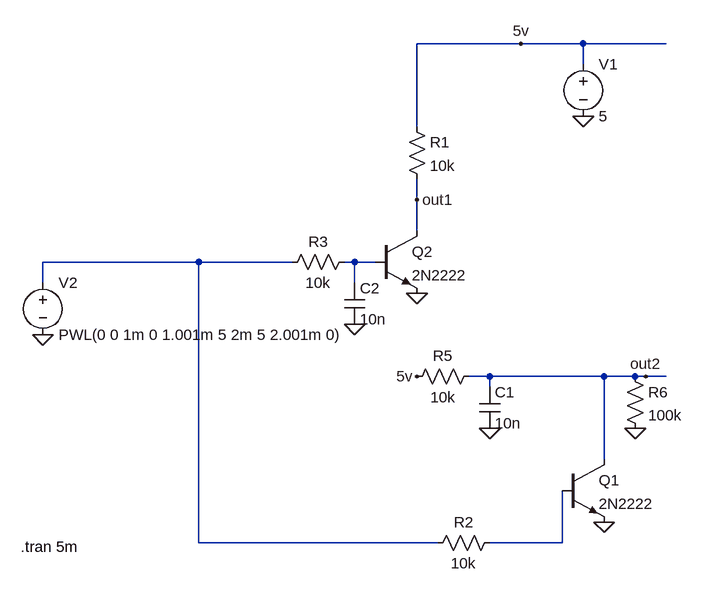
[diagram p0: schematic Draft7.asc]
Draft7.asc, the LTspice schematic file:
Version 4
SHEET 1 880 680
WIRE 144 -320 -16 -320
WIRE 240 -320 144 -320
WIRE 368 -320 240 -320
WIRE 240 -288 240 -320
WIRE -16 -192 -16 -320
WIRE -16 -80 -16 -112
WIRE -16 -32 -16 -80
WIRE -352 16 -592 16
WIRE -208 16 -352 16
WIRE -112 16 -128 16
WIRE -80 16 -112 16
WIRE -592 48 -592 16
WIRE -112 48 -112 16
WIRE 96 192 64 192
WIRE 272 192 96 192
WIRE 320 192 272 192
WIRE 336 192 320 192
WIRE 368 192 336 192
WIRE 96 208 96 192
WIRE 272 320 272 192
WIRE -352 448 -352 16
WIRE 16 448 -352 448
WIRE 208 448 208 368
WIRE 208 448 96 448
FLAG 240 -208 0
FLAG -16 64 0
FLAG 320 272 0
FLAG 144 -320 5v
FLAG -16 192 5v
FLAG -592 128 0
FLAG 96 272 0
FLAG -16 -80 out1
FLAG 336 192 out2
FLAG 272 416 0
FLAG -112 112 0
SYMBOL npn -80 -32 R0
SYMATTR InstName Q2
SYMATTR Value 2N2222
SYMBOL res -32 -208 R0
SYMATTR InstName R1
SYMATTR Value 10k
SYMBOL voltage 240 -304 R0
WINDOW 123 0 0 Left 0
WINDOW 39 0 0 Left 0
SYMATTR InstName V1
SYMATTR Value 5
SYMBOL res -112 0 R90
WINDOW 0 0 56 VBottom 2
WINDOW 3 32 56 VTop 2
SYMATTR InstName R3
SYMATTR Value 10k
SYMBOL res 80 176 R90
WINDOW 0 0 56 VBottom 2
WINDOW 3 32 56 VTop 2
SYMATTR InstName R5
SYMATTR Value 10k
SYMBOL res 304 176 R0
SYMATTR InstName R6
SYMATTR Value 100k
SYMBOL voltage -592 32 R0
WINDOW 123 0 0 Left 0
WINDOW 39 0 0 Left 0
SYMATTR InstName V2
SYMATTR Value PWL(0 0 1m 0 1.001m 5 2m 5 2.001m 0)
SYMBOL cap 80 208 R0
SYMATTR InstName C1
SYMATTR Value 10n
SYMBOL npn 208 320 R0
SYMATTR InstName Q1
SYMATTR Value 2N2222
SYMBOL res 112 432 R90
WINDOW 0 0 56 VBottom 2
WINDOW 3 32 56 VTop 2
SYMATTR InstName R2
SYMATTR Value 10k
SYMBOL cap -128 48 R0
SYMATTR InstName C2
SYMATTR Value 10n
TEXT -626 454 Left 2 !.tran 5m

The netlist it stands for:
* Draft7.asc
Q2 out1 N002 0 0 2N2222
R1 5v out1 10k
V1 5v 0 5
R3 N002 N001 10k
R5 out2 5v 10k
R6 out2 0 100k
V2 N001 0 PWL(0 0 1m 0 1.001m 5 2m 5 2.001m 0)
C1 out2 0 10n
Q1 out2 N003 0 0 2N2222
R2 N003 N001 10k
C2 N002 0 10n
.model NPN NPN
.model PNP PNP
.lib standard.bjt
.tran 5m
.backanno
.end